# Altium schematic sheet Tractor2000.SchDoc
size A3; SheetNumber: 1; SheetTotal: 4
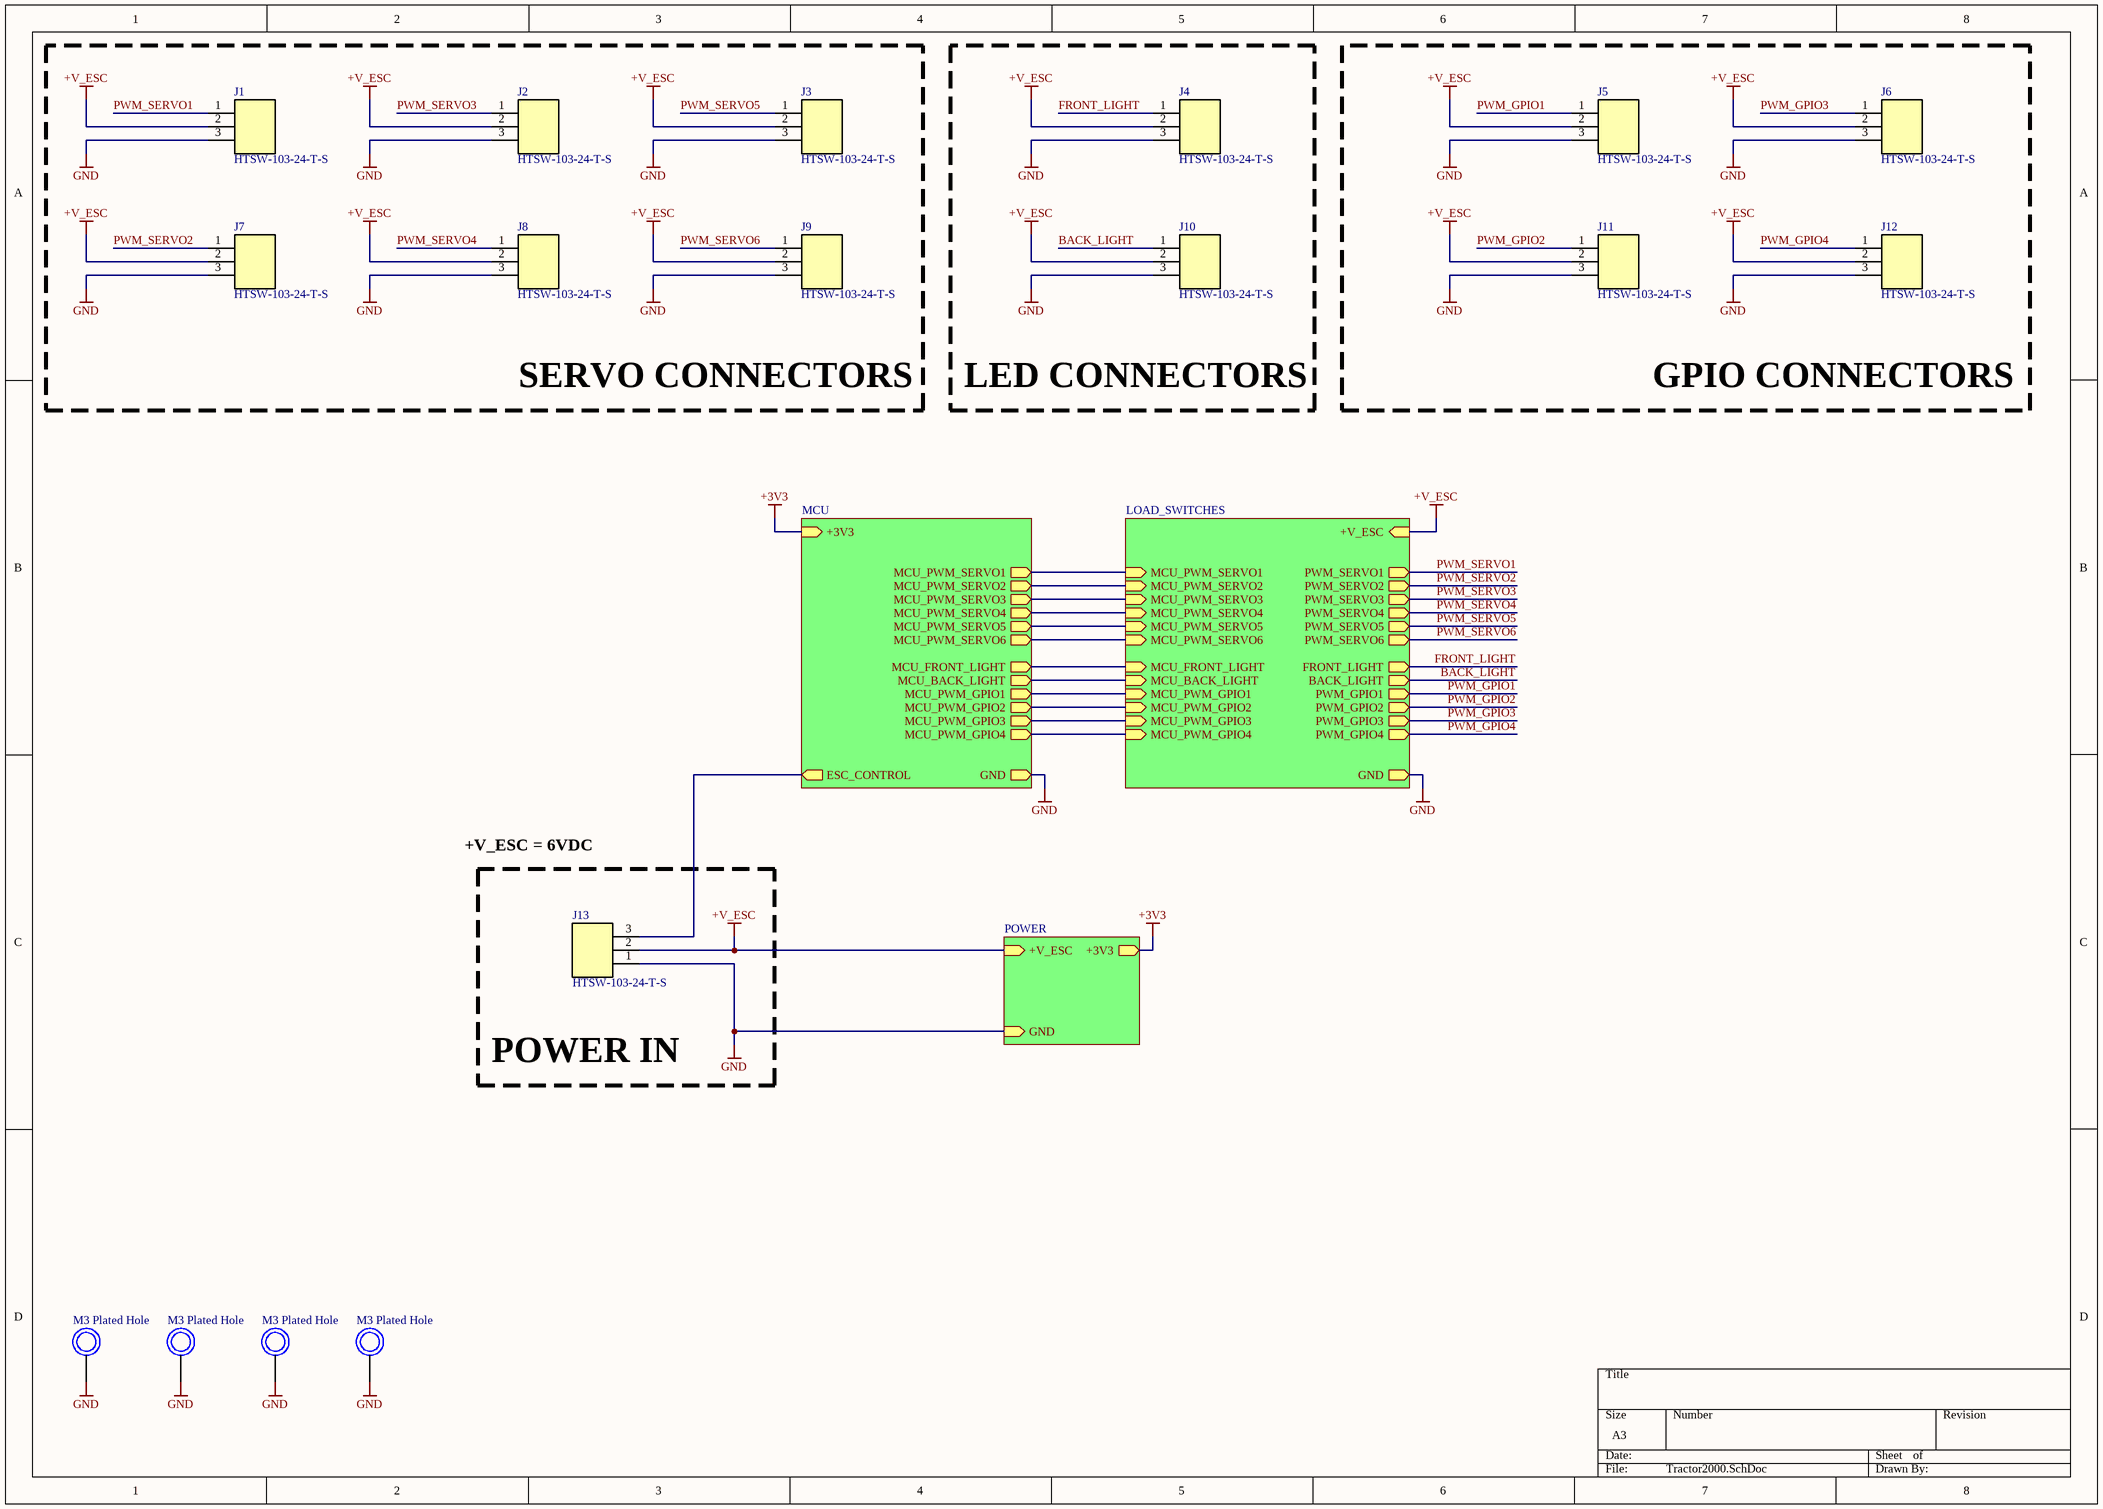
[diagram p0: Tractor2000.SchDoc]

## Parts
J1  HTSW-103-24-T-S  [CON3_1X3_TU_TSW_SAI]
J2  HTSW-103-24-T-S  [CON3_1X3_TU_TSW_SAI]
J3  HTSW-103-24-T-S  [CON3_1X3_TU_TSW_SAI]
J4  HTSW-103-24-T-S  [CON3_1X3_TU_TSW_SAI]
J5  HTSW-103-24-T-S  [CON3_1X3_TU_TSW_SAI]
J6  HTSW-103-24-T-S  [CON3_1X3_TU_TSW_SAI]
J7  HTSW-103-24-T-S  [CON3_1X3_TU_TSW_SAI]
J8  HTSW-103-24-T-S  [CON3_1X3_TU_TSW_SAI]
J9  HTSW-103-24-T-S  [CON3_1X3_TU_TSW_SAI]
J10  HTSW-103-24-T-S  [CON3_1X3_TU_TSW_SAI]
J11  HTSW-103-24-T-S  [CON3_1X3_TU_TSW_SAI]
J12  HTSW-103-24-T-S  [CON3_1X3_TU_TSW_SAI]
J13  HTSW-103-24-T-S  [CON3_1X3_TU_TSW_SAI]
MH1  M3 Plated Hole  [M3 Plated Hole]
MH2  M3 Plated Hole  [M3 Plated Hole]
MH3  M3 Plated Hole  [M3 Plated Hole]
MH4  M3 Plated Hole  [M3 Plated Hole]

## Blocks framed on the sheet
SERVO CONNECTORS: J1-J3 J7-J9
LED CONNECTORS: J4 J10
GPIO CONNECTORS: J5 J6 J11 J12
POWER IN: J13

## Sub-sheets
Designator = POWER: GND (in), +V_ESC (in), +3V3 (out)
Designator = MCU: GND (out), ESC_CONTROL (out), MCU_FRONT_LIGHT (out), MCU_BACK_LIGHT (out), MCU_PWM_GPIO1 (out), MCU_PWM_GPIO2 (out), MCU_PWM_GPIO3 (out), MCU_PWM_GPIO4 (out), MCU_PWM_SERVO4 (out), MCU_PWM_SERVO3 (out), MCU_PWM_SERVO2 (out), MCU_PWM_SERVO1 (out), MCU_PWM_SERVO5 (out), MCU_PWM_SERVO6 (out), +3V3 (in)
Designator = LOAD_SWITCHES: GND (out), FRONT_LIGHT (out), BACK_LIGHT (out), PWM_GPIO1 (out), PWM_GPIO2 (out), PWM_GPIO3 (out), MCU_FRONT_LIGHT (in), MCU_BACK_LIGHT (in), MCU_PWM_GPIO1 (in), MCU_PWM_GPIO2 (in), MCU_PWM_GPIO3 (in), MCU_PWM_GPIO4 (in), PWM_GPIO4 (out), MCU_PWM_SERVO1 (in), MCU_PWM_SERVO2 (in), MCU_PWM_SERVO3 (in), MCU_PWM_SERVO4 (in), MCU_PWM_SERVO6 (in), MCU_PWM_SERVO5 (in), PWM_SERVO1 (out), PWM_SERVO2 (out), PWM_SERVO3 (out), PWM_SERVO4 (out), PWM_SERVO5 (out), PWM_SERVO6 (out), +V_ESC (in)

## Nets
+3V3: sheet Designator/+3V3, sheet Designator/+3V3
+V_ESC: J1.2 J2.2 J3.2 J4.2 J5.2 J6.2 J7.2 J8.2 J9.2 J10.2 J11.2 J12.2 J13.2 ; sheet Designator/+V_ESC, sheet Designator/+V_ESC
GND: J1.3 J2.3 J3.3 J4.3 J5.3 J6.3 J7.3 J8.3 J9.3 J10.3 J11.3 J12.3 J13.1 MH1.1 MH2.1 MH3.1 MH4.1 ; sheet Designator/GND, sheet Designator/GND, sheet Designator/GND
BACK_LIGHT: J10.1 ; sheet Designator/BACK_LIGHT
FRONT_LIGHT: J4.1 ; sheet Designator/FRONT_LIGHT
PWM_GPIO1: J5.1 ; sheet Designator/PWM_GPIO1
PWM_GPIO2: J11.1 ; sheet Designator/PWM_GPIO2
PWM_GPIO3: J6.1 ; sheet Designator/PWM_GPIO3
PWM_GPIO4: J12.1 ; sheet Designator/PWM_GPIO4
PWM_SERVO1: J1.1 ; sheet Designator/PWM_SERVO1
PWM_SERVO2: J7.1 ; sheet Designator/PWM_SERVO2
PWM_SERVO3: J2.1 ; sheet Designator/PWM_SERVO3
PWM_SERVO4: J8.1 ; sheet Designator/PWM_SERVO4
PWM_SERVO5: J3.1 ; sheet Designator/PWM_SERVO5
PWM_SERVO6: J9.1 ; sheet Designator/PWM_SERVO6
NetJ13_3: J13.3 ; sheet Designator/ESC_CONTROL
(unnamed): sheet Designator/MCU_FRONT_LIGHT, sheet Designator/MCU_FRONT_LIGHT
(unnamed): sheet Designator/MCU_BACK_LIGHT, sheet Designator/MCU_BACK_LIGHT
(unnamed): sheet Designator/MCU_PWM_GPIO1, sheet Designator/MCU_PWM_GPIO1
(unnamed): sheet Designator/MCU_PWM_GPIO2, sheet Designator/MCU_PWM_GPIO2
(unnamed): sheet Designator/MCU_PWM_GPIO3, sheet Designator/MCU_PWM_GPIO3
(unnamed): sheet Designator/MCU_PWM_GPIO4, sheet Designator/MCU_PWM_GPIO4
(unnamed): sheet Designator/MCU_PWM_SERVO4, sheet Designator/MCU_PWM_SERVO4
(unnamed): sheet Designator/MCU_PWM_SERVO3, sheet Designator/MCU_PWM_SERVO3
(unnamed): sheet Designator/MCU_PWM_SERVO2, sheet Designator/MCU_PWM_SERVO2
(unnamed): sheet Designator/MCU_PWM_SERVO1, sheet Designator/MCU_PWM_SERVO1
(unnamed): sheet Designator/MCU_PWM_SERVO5, sheet Designator/MCU_PWM_SERVO5
(unnamed): sheet Designator/MCU_PWM_SERVO6, sheet Designator/MCU_PWM_SERVO6

## Notes on the sheet
- +V_ESC = 6VDC

## Library data of the parts
J1-J13 = HTSW-103-24-T-S: Description; Manufacturer_Name: Samtec Inc; Copyright: Copyright (C) 2026 Ultra Librarian. All rights reserved.; Manufacturer_Part_Number: HTSW-103-24-T-S; RefDes: RefDes; Type: Type
MH1-MH4 = CONN-00039-2